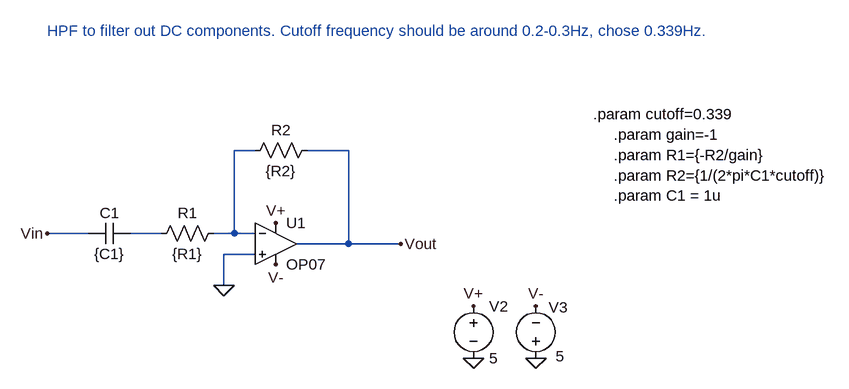
[diagram p0: schematic HPF.asc]
HPF.asc, the LTspice schematic file:
Version 4
SHEET 1 1684 680
WIRE 320 64 288 64
WIRE 464 64 400 64
WIRE 64 192 0 192
WIRE 176 192 128 192
WIRE 288 192 288 64
WIRE 288 192 256 192
WIRE 320 192 288 192
WIRE 464 208 464 64
WIRE 464 208 384 208
WIRE 544 208 464 208
WIRE 320 224 272 224
WIRE 272 272 272 224
FLAG 656 384 0
FLAG 752 384 0
FLAG 272 272 0
FLAG 352 240 V-
FLAG 752 304 V-
FLAG 352 176 V+
FLAG 656 304 V+
FLAG 544 208 Vout
FLAG 0 192 Vin
SYMBOL OpAmps\\OP07 352 144 R0
SYMATTR InstName U1
SYMBOL voltage 656 288 R0
WINDOW 123 0 0 Left 0
WINDOW 39 0 0 Left 0
SYMATTR InstName V2
SYMATTR Value 5
SYMBOL voltage 752 400 R180
WINDOW 0 -49 94 Left 2
WINDOW 3 -44 19 Left 2
WINDOW 123 0 0 Left 0
WINDOW 39 0 0 Left 0
SYMATTR InstName V3
SYMATTR Value 5
SYMBOL res 272 176 R90
WINDOW 0 0 56 VBottom 2
WINDOW 3 32 56 VTop 2
SYMATTR InstName R1
SYMATTR Value {R1}
SYMBOL res 416 48 R90
WINDOW 0 0 56 VBottom 2
WINDOW 3 32 56 VTop 2
SYMATTR InstName R2
SYMATTR Value {R2}
SYMBOL cap 128 176 R90
WINDOW 0 0 32 VBottom 2
WINDOW 3 32 32 VTop 2
SYMATTR InstName C1
SYMATTR Value {C1}
TEXT 0 -120 Left 2 ;HPF to filter out DC components. Cutoff frequency should be around 0.2-0.3Hz, chose 0.339Hz.
TEXT 840 8 Left 2 !.param cutoff=0.339
TEXT 872 40 Left 2 !.param gain=-1 \n.param R1={-R2/gain} \n.param R2={1/(2*pi*C1*cutoff)}\n.param C1 = 1u

The netlist it stands for:
* HPF.asc
XU1 0 N001 V+ V- Vout LT1001  ; OP07, pins In+ In- V+ V- OUT
V2 V+ 0 5
V3 0 V- 5
R1 N001 N002 {R1}
R2 Vout N001 {R2}
C1 N002 Vin {C1}
* HPF to filter out DC components. Cutoff frequency should be around 0.2-0.3Hz, chose 0.339Hz.
.param cutoff=0.339
.param gain=-1
.param R1={-R2/gain}
.param R2={1/(2*pi*C1*cutoff)}
.param C1 = 1u
.lib LTC.lib
.backanno
.end